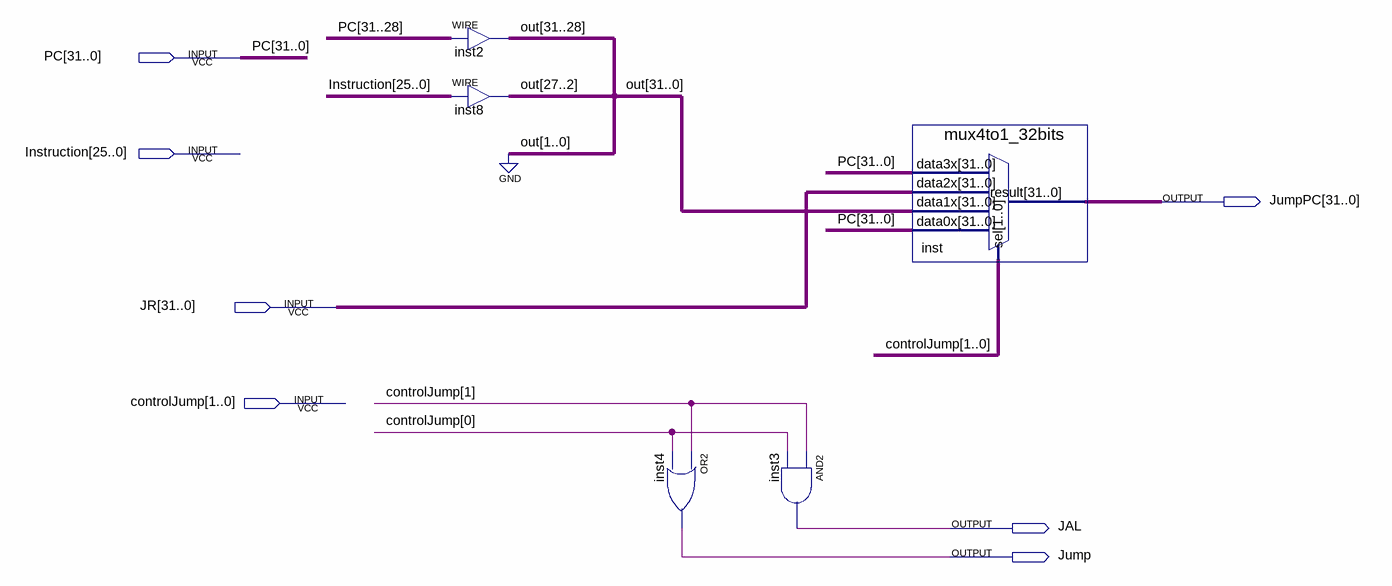
[diagram p0: schematic sheet]
// Quartus schematic controlPC.bdf as structural Verilog: 5 symbols, 7 pins
module controlPC (
  input  [31:0] PC,
  input  [25:0] Instruction,
  input  [31:0] JR,
  input  [1:0] controlJump,
  output [31:0] JumpPC,
  output JAL,
  output Jump
);

  wire [31:2] out;

  assign out[31:28] = PC[31:28];  // WIRE inst2
  assign out[27:2] = Instruction;  // WIRE inst8
  or inst4 (Jump, controlJump[1], controlJump[0]);
  and inst3 (JAL, controlJump[1], controlJump[0]);
  mux4to1_32bits inst (
    .data3x(PC), .data2x(JR), .data1x({out, 2'b00}), .data0x(PC), .sel(controlJump), .result(JumpPC));
endmodule
